# EasyEDA Pro project ProPrj_GoWinSDR_2025-10-27.epro, schematic Schematic1_1, sheets 5 to 8 of 8

## Sheets
5 Interface: Page Name: Interface; Update Date: 2025-09-11; Company: 嘉立创EDA
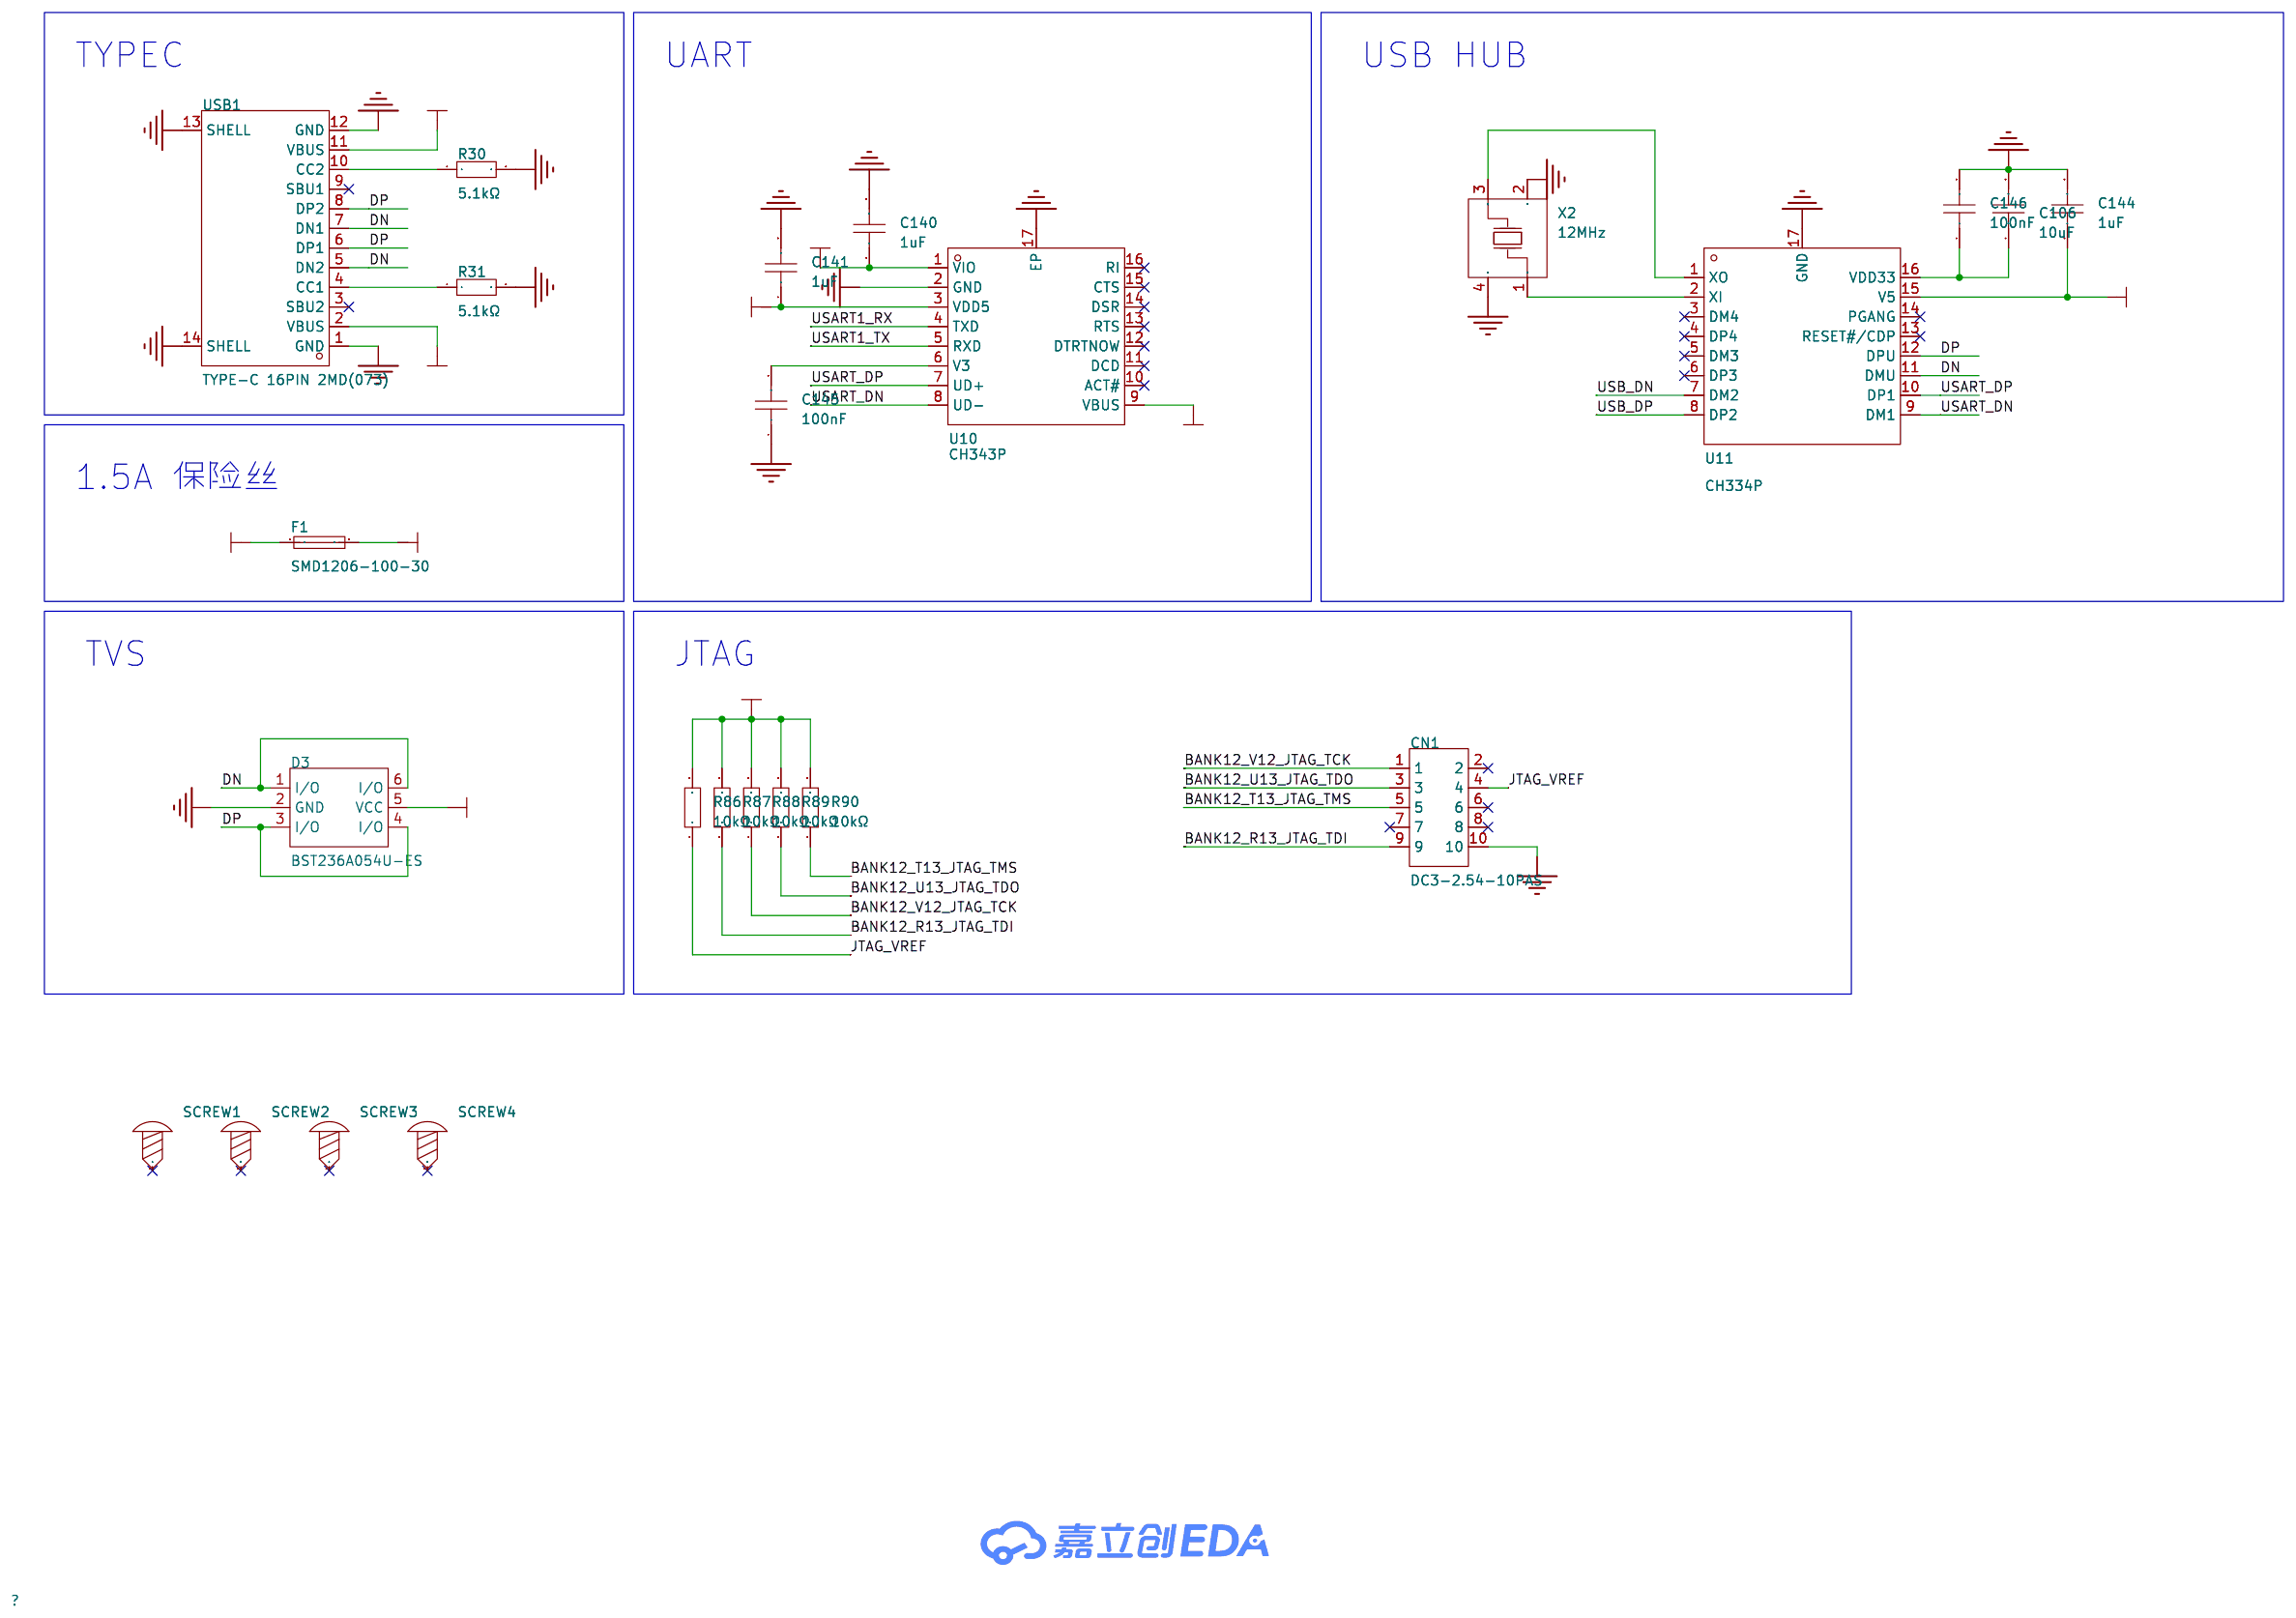
[diagram p4: Interface]
6 RF: Page Name: RF; Update Date: 2025-09-04; Company: 嘉立创EDA
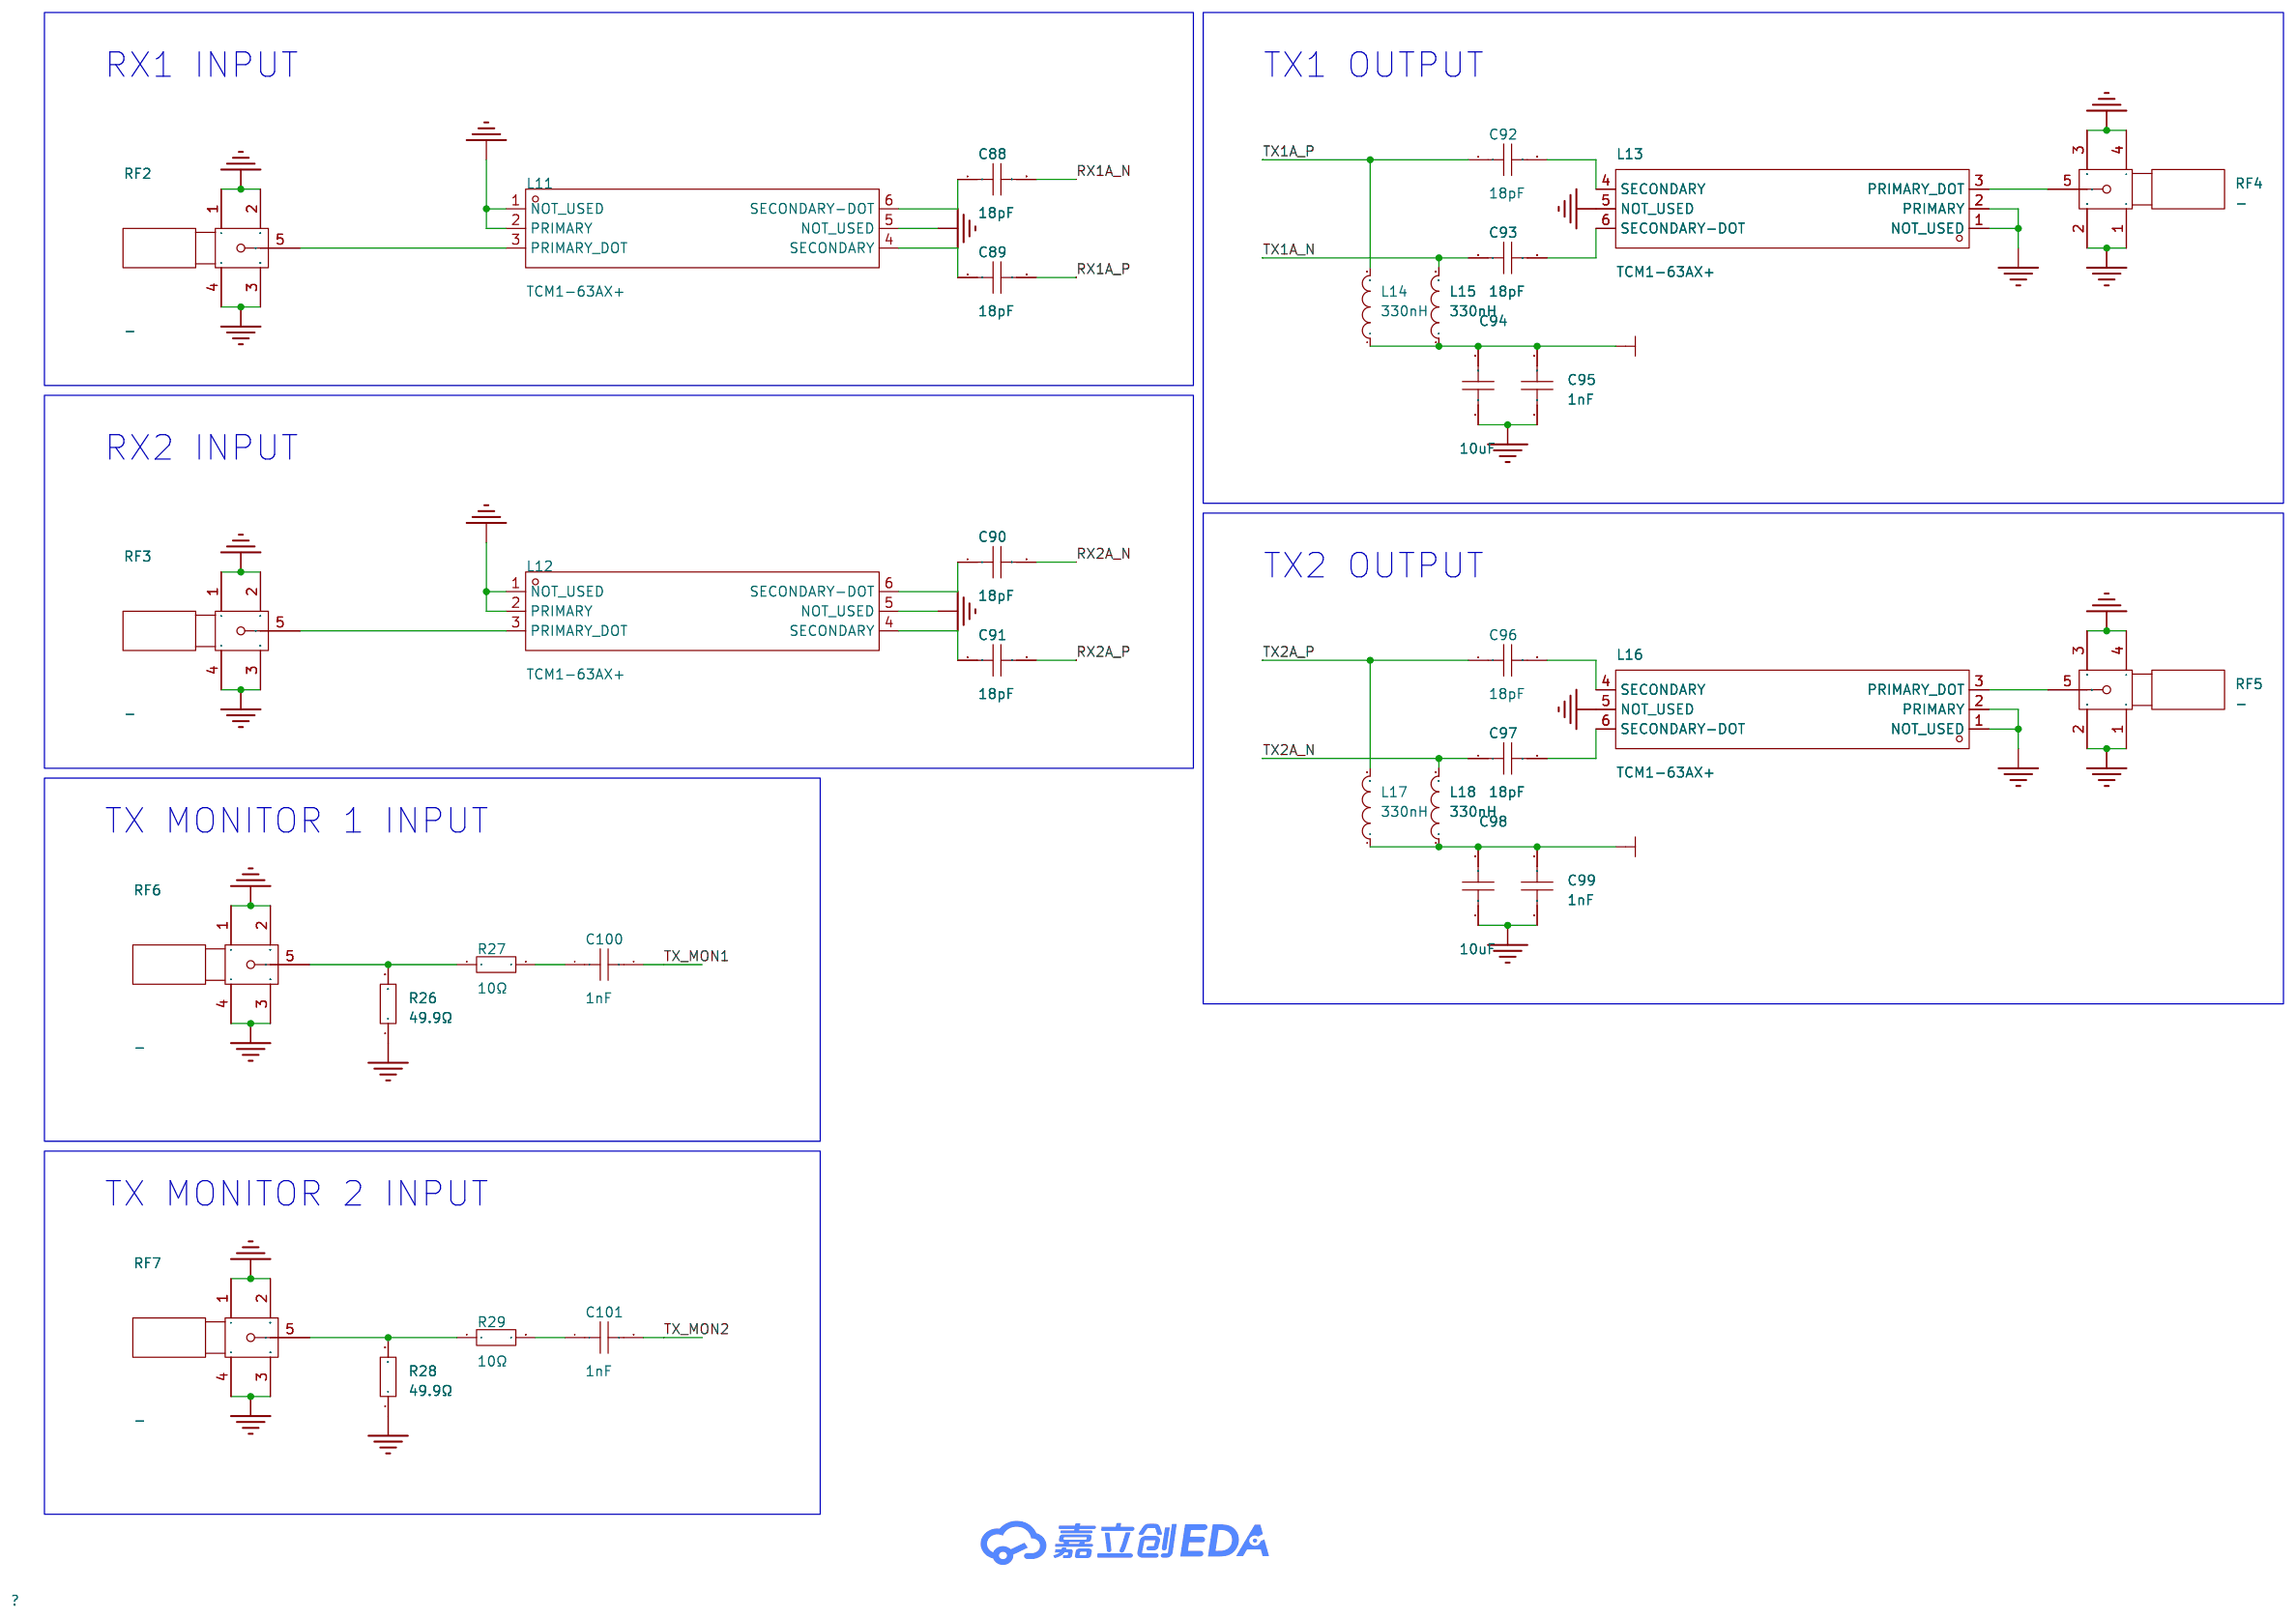
[diagram p5: RF]
7 ETHERNET: Board Name: Board1_1; Create Date: 2025-10-21; Page Name: ETHERNET; Schematic Name: Schematic1_1; Update Date: 2025-10-21; Company: 嘉立创EDA
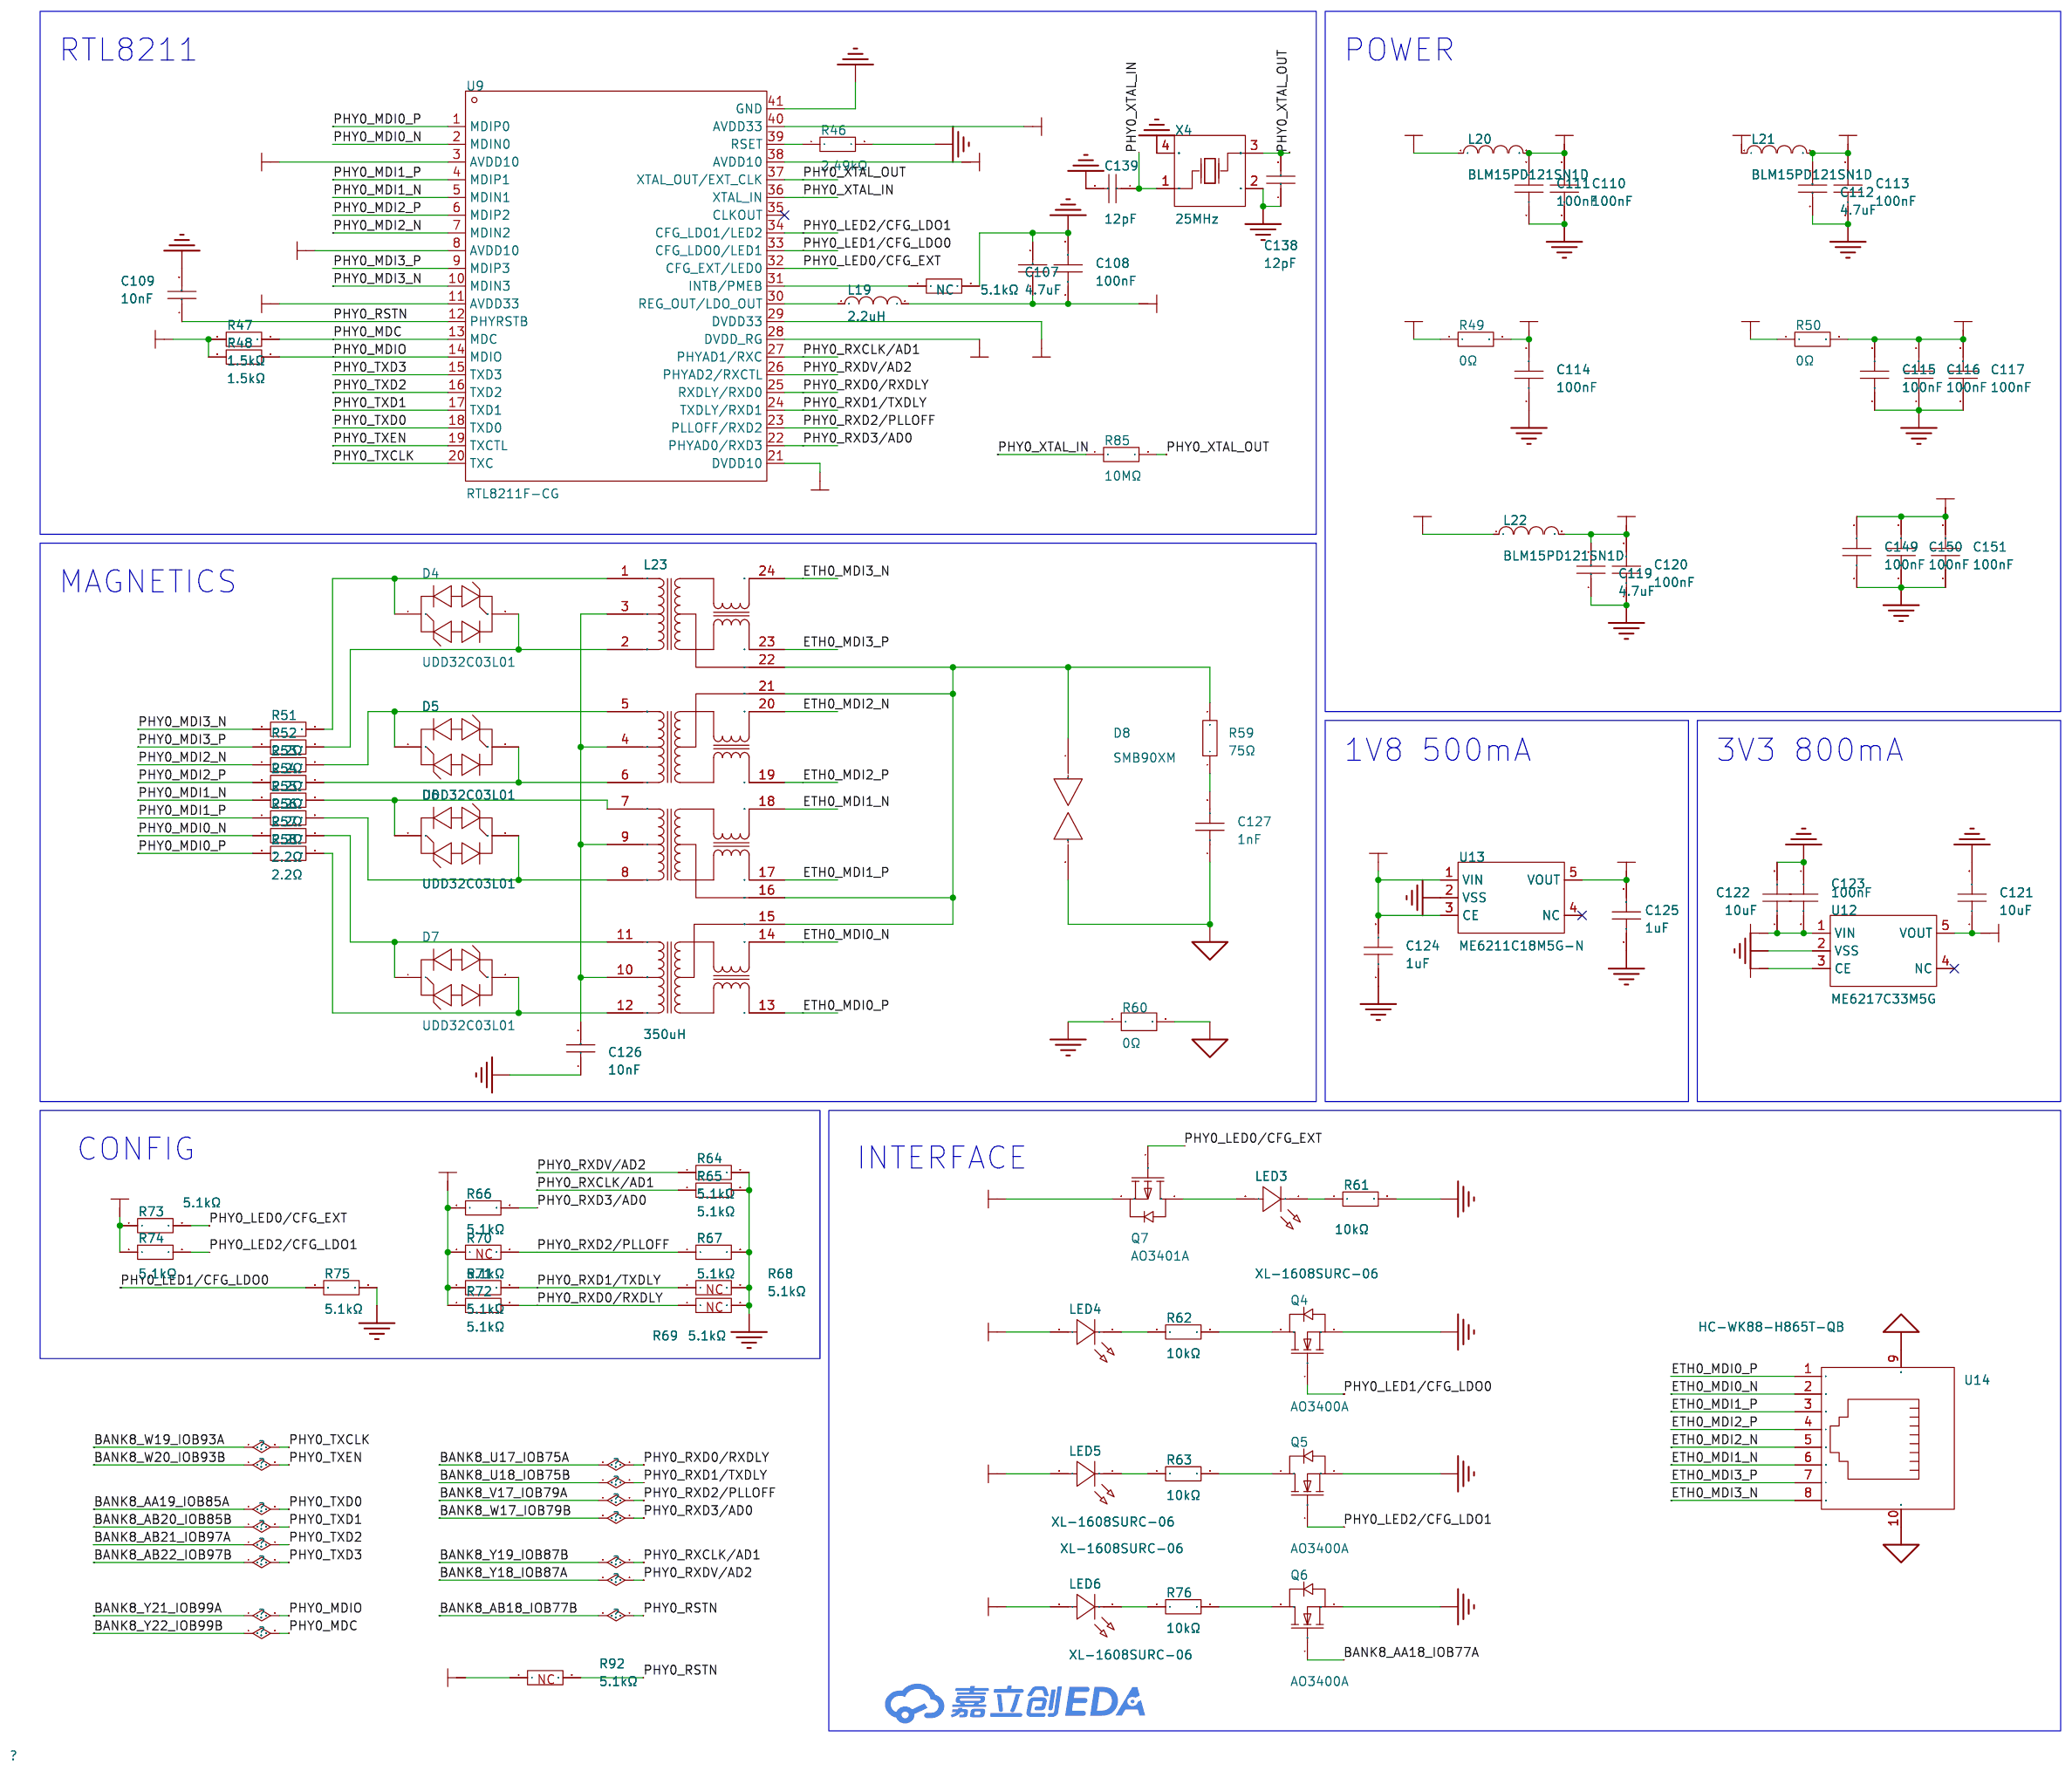
[diagram p6: ETHERNET]
8 USB: Create Date: 2025-09-07; Page Name: USB; Update Date: 2025-09-26; Company: 嘉立创EDA
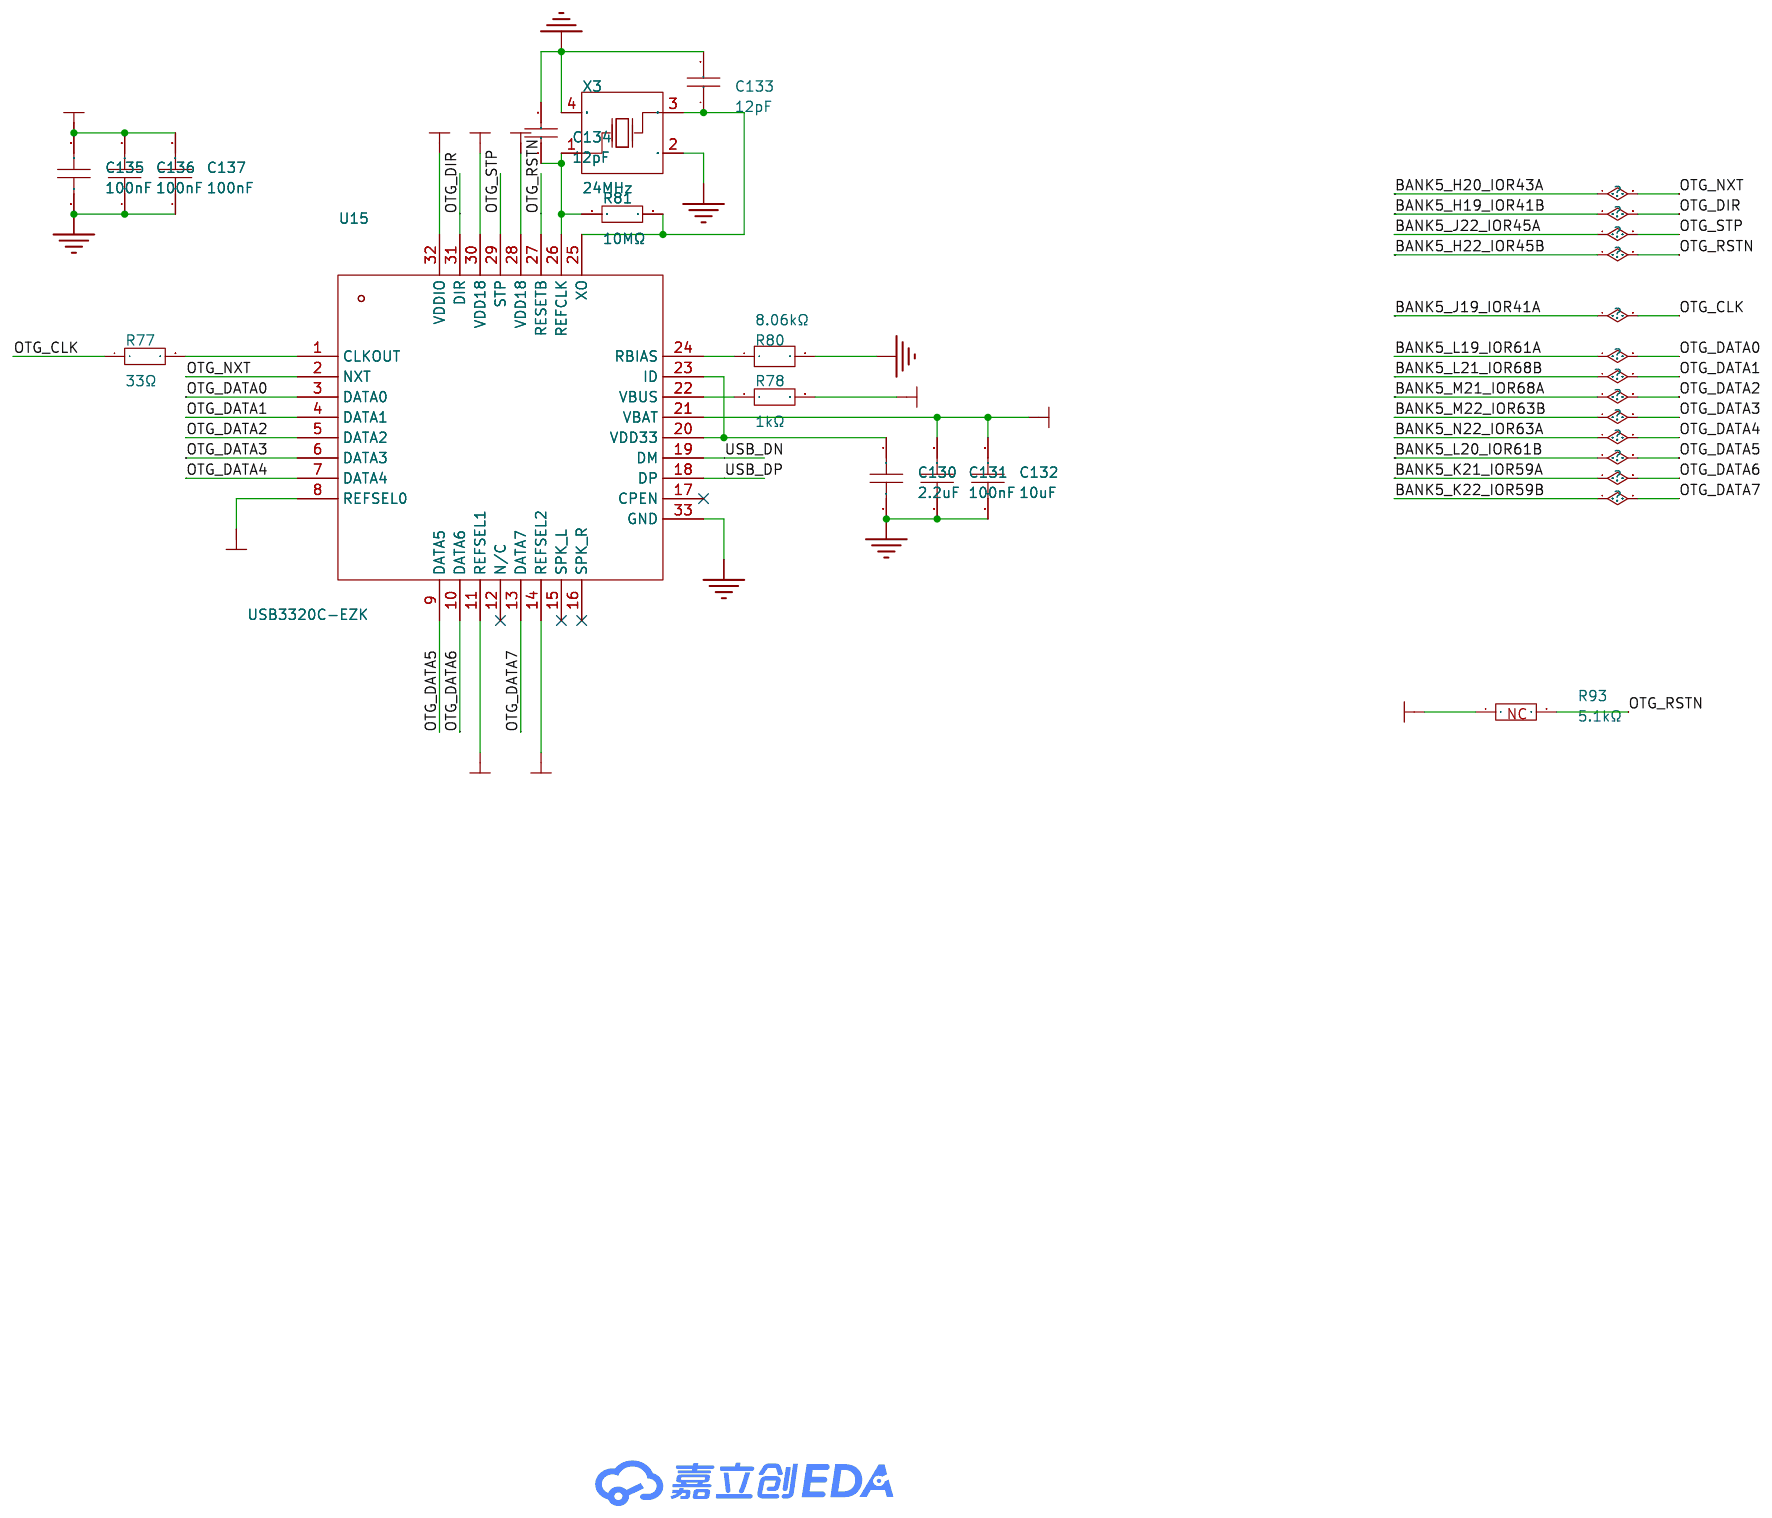
[diagram p7: USB]

## Parts
sheet ETHERNET
C107  4.7uF  [C0402]
C108  100nF  [C0402]
C109  10nF  [C0402]
C110  100nF  [C0402]
C111  100nF  [C0402]
C112  4.7uF  [C0402]
C113  100nF  [C0402]
C114  100nF  [C0402]
C115  100nF  [C0402]
C116  100nF  [C0402]
C117  100nF  [C0402]
C119  4.7uF  [C0402]
C120  100nF  [C0402]
C121  10uF  [C0603]
C122  10uF  [C0603]
C123  100nF  [C0603]
C124  1uF  [C0603]
C125  1uF  [C0603]
C126  10nF  [C0402]
C127  1nF  [C2220]
C138  12pF  [C0402]
C139  12pF  [C0402]
C149  100nF  [C0402]
C150  100nF  [C0402]
C151  100nF  [C0402]
D4  UDD32C03L01  [SOD-323_L1.7-W1.3-LS2.5-BI]
D5  UDD32C03L01  [SOD-323_L1.7-W1.3-LS2.5-BI]
D6  UDD32C03L01  [SOD-323_L1.7-W1.3-LS2.5-BI]
D7  UDD32C03L01  [SOD-323_L1.7-W1.3-LS2.5-BI]
D8  SMB90XM  [DIO-DT-SMD_L3.2-W1.6]
L19  2.2uH  [IND-SMD_L2.5-W2.0_MHCHL2520]
L20  BLM15PD121SN1D  [L0402]
L21  BLM15PD121SN1D  [L0402]
L22  BLM15PD121SN1D  [L0402]
L23  350uH  [XFMR-SMD_24P-L15.6-W8.5-P1.27-LS9.5-BL]
LED3  XL-1608SURC-06  [LED0603-RD_RED]
LED4  XL-1608SURC-06  [LED0603-RD_RED]
LED5  XL-1608SURC-06  [LED0603-RD_RED]
LED6  XL-1608SURC-06  [LED0603-RD_RED]
NC  5.1kΩ  [R0402]
Q4  AO3400A  [SOT-23-3_L2.9-W1.3-P1.90-LS2.4-BR]
Q5  AO3400A  [SOT-23-3_L2.9-W1.3-P1.90-LS2.4-BR]
Q6  AO3400A  [SOT-23-3_L2.9-W1.3-P1.90-LS2.4-BR]
Q7  AO3401A  [SOT-23_L2.9-W1.3-P1.90-LS2.4-BR]
R46  2.49kΩ  [R0402]
R47  1.5kΩ  [R0402]
R48  1.5kΩ  [R0402]
R49  0Ω  [R0402]
R50  0Ω  [R0402]
R51  2.2Ω  [R0402]
R52  2.2Ω  [R0402]
R53  2.2Ω  [R0402]
R54  2.2Ω  [R0402]
R55  2.2Ω  [R0402]
R56  2.2Ω  [R0402]
R57  2.2Ω  [R0402]
R58  2.2Ω  [R0402]
R59  75Ω  [R1206]
R60  0Ω  [R1206]
R61  10kΩ  [R0402]
R62  10kΩ  [R0402]
R63  10kΩ  [R0402]
R64  5.1kΩ  [R0402]
R65  5.1kΩ  [R0402]
R66  5.1kΩ  [R0402]
R67  5.1kΩ  [R0402]
R68  5.1kΩ  [R0402]
R69  5.1kΩ  [R0402]
R70  5.1kΩ  [R0402]
R71  5.1kΩ  [R0402]
R72  5.1kΩ  [R0402]
R73  5.1kΩ  [R0402]
R74  5.1kΩ  [R0402]
R75  5.1kΩ  [R0402]
R76  10kΩ  [R0402]
R85  10MΩ  [R0402]
R92  5.1kΩ  [R0402]
U9  RTL8211F-CG  [WQFN-40_L5.0-W5.0-P0.4-BL-EP]
U12  ME6217C33M5G  [SOT-23-5_L3.0-W1.7-P0.95-LS2.8-BR]
U13  ME6211C18M5G-N  [SOT-23-5_L3.0-W1.7-P0.95-LS2.8-BR]
U14  HC-WK88-H865T-QB  [RJ45-TH_HC-WK88-H865T-BB]
X4  25MHz  [CRYSTAL-SMD_4P-L3.2-W2.5-BL]
sheet Interface
C106  10uF  [C0603]
C140  1uF  [C0402]
C141  1uF  [C0402]
C144  1uF  [C0402]
C145  100nF  [C0402]
C146  100nF  [C0402]
CN1  DC3-2.54-10PAS  [CONN-TH_10P-P2.54_DC3-2.54-10PAS]
D3  BST236A054U-ES  [SOT-23-6_L2.9-W1.6-P0.95-LS2.8-TL]
F1  SMD1206-100-30  [F1206]
R30  5.1kΩ  [R0402]
R31  5.1kΩ  [R0402]
R86  10kΩ  [R0402]
R87  10kΩ  [R0402]
R88  10kΩ  [R0402]
R89  10kΩ  [R0402]
R90  10kΩ  [R0402]
SCREW1  -  [M3螺丝]
SCREW2  -  [M3螺丝]
SCREW3  -  [M3螺丝]
SCREW4  -  [M3螺丝]
U10  CH343P  [TQFN-16_L3.0-W3.0-P0.50-BL-EP1.7]
U11  CH334P  [QFN-16_L3.0-W3.0-P0.50-BL-EP1.7]
USB1  TYPE-C 16PIN 2MD(073)  [USB-C-SMD_TYPE-C-6PIN-2MD-073]
X2  12MHz  [CRYSTAL-SMD_4P-L3.2-W2.5-BL]
sheet RF
C88  18pF  [C0402]
C89  18pF  [C0402]
C90  18pF  [C0402]
C91  18pF  [C0402]
C92  18pF  [C0402]
C93  18pF  [C0402]
C94  10uF  [C0603]
C95  1nF  [C0402]
C96  18pF  [C0402]
C97  18pF  [C0402]
C98  10uF  [C0603]
C99  1nF  [C0402]
C100  1nF  [C0402]
C101  1nF  [C0402]
L11  TCM1-63AX+  [XFMR-SMD_TCM1-63AX]
L12  TCM1-63AX+  [XFMR-SMD_TCM1-63AX]
L13  TCM1-63AX+  [XFMR-SMD_TCM1-63AX]
L14  330nH  [IND-SMD_L1.0-W0.6]
L15  330nH  [IND-SMD_L1.0-W0.6]
L16  TCM1-63AX+  [XFMR-SMD_TCM1-63AX]
L17  330nH  [IND-SMD_L1.0-W0.6]
L18  330nH  [IND-SMD_L1.0-W0.6]
R26  49.9Ω  [R0402]
R27  10Ω  [R0402]
R28  49.9Ω  [R0402]
R29  10Ω  [R0402]
RF2  -  [SMA-SMD_BWSMA-KE-P001]
RF3  -  [SMA-SMD_BWSMA-KE-P001]
RF4  -  [SMA-SMD_BWSMA-KE-P001]
RF5  -  [SMA-SMD_BWSMA-KE-P001]
RF6  -  [SMA-SMD_BWSMA-KE-P001]
RF7  -  [SMA-SMD_BWSMA-KE-P001]
sheet USB
C130  2.2uF  [C0402]
C131  100nF  [C0402]
C132  10uF  [C0603]
C133  12pF  [C0402]
C134  12pF  [C0402]
C135  100nF  [C0402]
C136  100nF  [C0402]
C137  100nF  [C0402]
R77  33Ω  [R0402]
R78  1kΩ  [R0402]
R80  8.06kΩ  [R0402]
R81  10MΩ  [R0402]
R93  5.1kΩ  [R0402]
U15  USB3320C-EZK  [QFN-32_L5.0-W5.0-P0.50-BL-EP3.4]
X3  24MHz  [CRYSTAL-SMD_4P-L3.2-W2.5-BL]

## Library data of the parts
C107 C112 C119 = CL05A475MP5NRNC: 容值:4.7uF;精度:±20%;额定电压:10V;温度系数:X5R;; LCSC Part Name: 4.7uF ±20% 10V; Supplier Part: C23733; Manufacturer: SAMSUNG(三星); Supplier Footprint: 0402; JLCPCB Part Class: 基础库; Datasheet: https://item.szlcsc.com/datasheet/CL05A475MP5NRNC/24469.html; Supplier: LCSC; Tolerance: ±20%; Voltage Rating: 10V; Temperature Coefficient: X5R
C108 C113 C120 = GRM155R71H104KE14D: 容值:100nF;精度:±10%;额定电压:50V;材质(温度系数):X7R;; LCSC Part Name: 100nF ±10% 50V; Supplier Part: C77020; Manufacturer: muRata(村田); Supplier Footprint: 0402; JLCPCB Part Class: 扩展库; Datasheet: https://atta.szlcsc.com/upload/public/pdf/source/20180326/C77020_39BD49C951FF1AF0DB1F1FAC5AC1E401.pdf; Supplier: LCSC; Tolerance: ±10%; Voltage Rated: 50V; Temperature Coefficient: X7R
C109 C126 = CL05B103KB5NNNC: 容值:10nF;精度:±10%;额定电压:50V;温度系数:X7R;; LCSC Part Name: 10nF ±10% 50V; Supplier Part: C15195; Manufacturer: SAMSUNG(三星); Supplier Footprint: 0402; JLCPCB Part Class: 基础库; Datasheet: https://item.szlcsc.com/datasheet/CL05B103KB5NNNC/15869.html; Supplier: LCSC; Tolerance: ±10%; Voltage Rating: 50V; Temperature Coefficient: X7R
C110 C111 C114-C117 C131 C135-C137 C145 C146 C149-C151 = CL05B104KB54PNC: 容值:100nF;精度:±10%;额定电压:50V;温度系数:X7R;; LCSC Part Name: 100nF ±10% 50V; Supplier Part: C307331; Manufacturer: SAMSUNG(三星); Supplier Footprint: 0402; JLCPCB Part Class: 基础库; Datasheet: https://item.szlcsc.com/datasheet/CL05B104KB54PNC/291005.html; Supplier: LCSC; Tolerance: ±10%; Voltage Rating: 50V; Temperature Coefficient: X7R
C94 C98 C106 C121 C122 C132 = CGA0603X5R106K100JT: 容值:10uF;精度:±10%;额定电压:10V;温度系数:X5R;; LCSC Part Name: 10uF ±10% 10V; Supplier Part: C6119842; Manufacturer: HRE(芯声); Supplier Footprint: 0603; JLCPCB Part Class: 扩展库; Supplier: LCSC; Tolerance: ±10%; Voltage Rating: 10V; Temperature Coefficient: X5R
C123 = CGA0603X7R104K500JT: 容值:100nF;精度:±10%;额定电压:50V;温度系数:X7R;; LCSC Part Name: 100nF ±10% 50V; Supplier Part: C6119867; Manufacturer: HRE(芯声); Supplier Footprint: 0603; JLCPCB Part Class: 扩展库; Datasheet: https://atta.szlcsc.com/upload/public/pdf/source/20250103/C44077DA9E7B3EFAE02F22B6D3D1CBC9.pdf; Supplier: LCSC; Tolerance: ±10%; Voltage Rating: 50V; Temperature Coefficient: X7R
C124 C125 = CGA0603X5R105K500JT: 容值:1uF;精度:±10%;额定电压:50V;温度系数:X5R;; LCSC Part Name: 1uF ±10% 50V; Supplier Part: C6119852; Manufacturer: HRE(芯声); Supplier Footprint: 0603; JLCPCB Part Class: 扩展库; Supplier: LCSC; Tolerance: ±10%; Voltage Rating: 50V; Temperature Coefficient: X5R
C127 = C2220X102K202T: 容值:1nF;精度:±10%;额定电压:2kV;温度系数:X7R;; LCSC Part Name: 1nF ±10% 2kV; Supplier Part: C2940745; Manufacturer: IHHEC(禾伸堂); Supplier Footprint: 2220; JLCPCB Part Class: 扩展库; Datasheet: https://item.szlcsc.com/datasheet/C2220X102K202T/3306377.html; Supplier: LCSC; Tolerance: ±10%; Voltage Rating: 2kV; Temperature Coefficient: X7R
C133 C134 C138 C139 = GRM1555C1H120JA01D: 容值:12pF;精度:±5%;额定电压:50V;温度系数:C0G;; LCSC Part Name: 12pF ±5% 50V; Supplier Part: C76948; Manufacturer: muRata(村田); Supplier Footprint: 0402; JLCPCB Part Class: 扩展库; Datasheet: https://item.szlcsc.com/datasheet/GRM1555C1H120JA01D/78075.html; Supplier: LCSC; Tolerance: ±5%; Voltage Rating: 50V; Temperature Coefficient: C0G
D4-D7 = UDD32C03L01_C42165090: 反向截止电压(Vrwm):3.3V;钳位电压:7V;峰值脉冲电流(Ipp):19A;峰值脉冲功率(Ppp):350W;击穿电压:4V;; Supplier Part: C42165090; Manufacturer: UMW(友台半导体); Supplier Footprint: SOD-323; Datasheet: https://item.szlcsc.com/datasheet/UDD32C03L01/44034558.html; Supplier: LCSC; Reverse Stand-Off Voltage (Vrwm): 3.3V; Clamping Voltage: 7V; Peak Pulse Current (Ipp): 19A; Peak Pulse Power Dissipation (Ppp): 350W; Voltage - Breakdown: 4V; Reverse Leakage Current (Ir): 5uA; Number of Channels: 单路; Operating Temperature: -55℃~+150℃; level of protection: IEC 61000-4-2; Type: TVS; Junction Capacitance: 0.8pF
D8 = SMB90XM: 极数:2;击穿电压:90V;精度:±30%;脉冲放电电流:500A;; LCSC Part Name: 90V 500A 2端 1206GDT; Supplier Part: C527147; Manufacturer: SURGING(绍鑫); Supplier Footprint: 1206; JLCPCB Part Class: 扩展库; Datasheet: https://atta.szlcsc.com/upload/public/pdf/source/20200508/C527150_F0D53D7FAFC2AA44B5719B72ADFAED31.pdf; Supplier: LCSC; Number of Poles: 2; Voltage - DC Spark Over (Nom): 90V; Tolerance: ±30%; Impulse Discharge Current: 500A; inter-electrode capacitance: 0.5pF
L19 = FTC252012S2R2MBCA: 电感值:2.2uH;精度:±20%;额定电流:3A;饱和电流(Isat):3.8A;类型:一体成型电感;; LCSC Part Name: 2.2uH ±20% 3.8A; Supplier Part: C5832372; Manufacturer: cjiang(长江微电); Supplier Footprint: 1008; JLCPCB Part Class: 扩展库; Datasheet: https://atta.szlcsc.com/upload/public/pdf/source/20230602/8FFEDA9C0247A92A0D4B67554BFE4091.pdf; Supplier: LCSC; Tolerance: ±20%; Rated Current: 3A; Saturation Current (Isat): 3.8A; DC Resistance (DCR): 55mΩ; Type: 一体成型电感
L20-L22 = BLM15PD121SN1D: 阻抗@频率:120Ω@100MHz;误差:±25%;直流电阻(DCR):90mΩ;; LCSC Part Name: 单路 0402磁珠 阻抗120Ω@100MHz; Supplier Part: C76891; Manufacturer: muRata(村田); Supplier Footprint: 0402; JLCPCB Part Class: 扩展库; Datasheet: https://item.szlcsc.com/datasheet/BLM15PD121SN1D/78018.html; Supplier: LCSC; Impedance @ Frequency: 120Ω@100MHz; Tolerance: ±25%; DC Resistance(DCR): 90mΩ; Current Rating: 1.3A; Number of Circuits: 1; Operating Temperature: -55℃~+125℃
L23 = HM82409S: 匝数比:1:1;端口数量:单口;速率:1000M;; Supplier Part: C48392699; Manufacturer: CND-tek(磁联达); Supplier Footprint: SMD-24P,15.6x8.5mm; JLCPCB Part Class: 扩展库; Datasheet: https://atta.szlcsc.com/upload/public/pdf/source/20250418/F0A2D7AC90CE8B5B5C678EEBBDC00628.pdf; Supplier: LCSC; Turns Ratio: 1:1; Number of Channels: 单口; rate: 1000M; Isolation Voltage(Vrms): 1.5kV; operating temperature: 0℃~+70℃
LED3-LED6 = XL-1608SURC-06: 灯头类型:-;发光颜色:红色;正向压降(Vf):2.3V;功率:50mW;正向电流:20mA;波长:620nm~630nm;二极管配置:-;透镜颜色:无色透明透镜;色温:-;发光强度:225mcd;发光角度:120°;载带方式:正贴;工作温度:-20℃~+85℃;; Supplier Part: C965799; Manufacturer: XINGLIGHT(成兴光); Supplier Footprint: 0603; JLCPCB Part Class: 扩展库; Datasheet: https://atta.szlcsc.com/upload/public/pdf/source/20250213/F9766CE804AF391355DCDD48DB3E0DAB.pdf; Supplier: LCSC; Illumination Color: 红色; Voltage - Forward(Vf): 2.3V; Power(Watts): 50mW; Forward Current: 20mA; Wavelength - Dominant: 620nm~630nm; Peak Wavelength: 625nm; Lens Color: 无色透明透镜; Luminous Intensity: 225mcd; Viewing Angle: 120°; Mounting Sytle: 正贴; Operating Temperature: -20℃~+85℃
NC R30 R31 R64-R75 R92 R93 = 0402WGF5101TCE: 电阻类型:厚膜电阻;阻值:5.1kΩ;精度:±1%;功率:62.5mW;工作电压:50V;温度系数:±100ppm/℃;; LCSC Part Name: 5.1kΩ ±1% 62.5mW 厚膜电阻; Supplier Part: C25905; Manufacturer: UNI-ROYAL(厚声); Supplier Footprint: 0402; JLCPCB Part Class: 基础库; Datasheet: https://item.szlcsc.com/datasheet/0402WGF5101TCE/26648.html; Supplier: LCSC; Type: 厚膜电阻; Tolerance: ±1%; Power(Watts): 62.5mW; Voltage-Supply(Max): 50V; Temperature Coefficient: ±100ppm/℃; Operating Temperature: -55℃~+155℃
Q4-Q6 = AO3400A_C20917: 数量:-;漏源电压(Vdss):30V;连续漏极电流(Id):-;导通电阻(RDS(on)):48mΩ@2.5V;耗散功率(Pd):-;阈值电压(Vgs(th)):1.45V@250uA;; LCSC Part Name: 1个N沟道 耐压:30V 电流:5.7A; Supplier Part: C20917; Manufacturer: AOS; Supplier Footprint: SOT-23-3L; JLCPCB Part Class: 基础库; Datasheet: https://item.szlcsc.com/datasheet/AO3400A/21629.html; Supplier: LCSC; Drain to Source Voltage: 30V; RDS(on): 48mΩ@2.5V; Gate Threshold Voltage (Vgs(th)): 1.45V@250uA; Gate Charge(Qg): 7nC@10V; Input Capacitance(Ciss): 630pF@15V; Operating Temperature: -55℃~+150℃@(Tj); Type: N沟道
Q7 = AO3401A_C15127: 数量:1个P沟道;漏源电压(Vdss):30V;连续漏极电流(Id):4A;导通电阻(RDS(on)):47mΩ@10V；85mΩ@2.5V；60mΩ@4.5V;耗散功率(Pd):-;阈值电压(Vgs(th)):900mV@250uA;; LCSC Part Name: 1个P沟道 耐压:30V 电流:4A; Supplier Part: C15127; Manufacturer: AOS; Supplier Footprint: SOT-23; JLCPCB Part Class: 基础库; Datasheet: https://item.szlcsc.com/datasheet/AO3401A/15801.html; Supplier: LCSC; Number: 1个P沟道; Drain to Source Voltage: 30V; Current - Continuous Drain(Id): 4A; RDS(on): 47mΩ@10V；85mΩ@2.5V；60mΩ@4.5V; Gate Threshold Voltage (Vgs(th)): 900mV@250uA; Gate Charge(Qg): 14nC@10V; Input Capacitance(Ciss): 645pF; Reverse Transfer Capacitance (Crss@Vds): 55pF; Output Capacitance(Coss): 80pF
R46 = 0402WGF2491TCE: 电阻类型:厚膜电阻;阻值:2.49kΩ;精度:±1%;功率:62.5mW;工作电压:50V;温度系数:±100ppm/℃;; LCSC Part Name: 2.49kΩ ±1% 62.5mW 厚膜电阻; Supplier Part: C25884; Manufacturer: UNI-ROYAL(厚声); Supplier Footprint: 0402; JLCPCB Part Class: Extended Part; Datasheet: https://item.szlcsc.com/datasheet/0402WGF2491TCE/26627.html; Supplier: LCSC; Type: 厚膜电阻; Tolerance: ±1%; Power(Watts): 62.5mW; Voltage-Supply(Max): 50V; Temperature Coefficient: ±100ppm/℃; Operating Temperature: -55℃~+155℃
R47 R48 = 0402WGF1501TCE: 电阻类型:厚膜电阻;阻值:1.5kΩ;精度:±1%;功率:62.5mW;最大工作电压:50V;温度系数:±100ppm/℃;; LCSC Part Name: 1.5kΩ ±1% 62.5mW 厚膜电阻; Supplier Part: C25867; Manufacturer: UNI-ROYAL(厚声); Supplier Footprint: 0402; JLCPCB Part Class: 基础库; Datasheet: https://atta.szlcsc.com/upload/public/pdf/source/20200306/C422600_1E6D84923E4A46A82E41ADD87F860B5C.pdf; Supplier: LCSC; Type: 厚膜电阻; Tolerance: ±1%; Power(Watts): 62.5mW; Overload Voltage (Max): 50V; Temperature Coefficient: ±100ppm/℃; Operating Temperature Range: -55℃~+155℃
R49 R50 = 0402WGF0000TCE: 电阻类型:厚膜电阻;阻值:0Ω;精度:±1%;功率:62.5mW;工作电压:50V;温度系数:±800ppm/℃;; LCSC Part Name: 0Ω ±1% 62.5mW 厚膜电阻; Supplier Part: C17168; Manufacturer: UNI-ROYAL(厚声); Supplier Footprint: 0402; JLCPCB Part Class: 基础库; Datasheet: https://item.szlcsc.com/datasheet/0402WGF0000TCE/17853.html; Supplier: LCSC; Type: 厚膜电阻; Tolerance: ±1%; Power(Watts): 62.5mW; Voltage-Supply(Max): 50V; Temperature Coefficient: ±800ppm/℃; Operating Temperature: -55℃~+155℃
R51-R58 = 0402WGF220KTCE: 电阻类型:厚膜电阻;阻值:2.2Ω;精度:±1%;功率:62.5mW;最大工作电压:50V;温度系数:±200ppm/℃;; LCSC Part Name: 2.2Ω ±1% 62.5mW 厚膜电阻; Supplier Part: C25101; Manufacturer: UNI-ROYAL(厚声); Supplier Footprint: 0402; JLCPCB Part Class: 扩展库; Datasheet: https://atta.szlcsc.com/upload/public/pdf/source/20200306/C422600_1E6D84923E4A46A82E41ADD87F860B5C.pdf; Supplier: LCSC; Type: 厚膜电阻; Tolerance: ±1%; Power(Watts): 62.5mW; Overload Voltage (Max): 50V; Temperature Coefficient: ±200ppm/℃; Operating Temperature Range: -55℃~+155℃
R59 = 1206W4F750JT5E: 电阻类型:厚膜电阻;阻值:75Ω;精度:±1%;功率:250mW;最大工作电压:200V;温度系数:±100ppm/℃;; LCSC Part Name: 75Ω ±1% 250mW 厚膜电阻; Supplier Part: C17987; Manufacturer: UNI-ROYAL(厚声); Supplier Footprint: 1206; JLCPCB Part Class: 扩展库; Datasheet: https://atta.szlcsc.com/upload/public/pdf/source/20200306/C422600_1E6D84923E4A46A82E41ADD87F860B5C.pdf; Supplier: LCSC; Type: 厚膜电阻; Tolerance: ±1%; Power(Watts): 250mW; Overload Voltage (Max): 200V; Temperature Coefficient: ±100ppm/℃; Operating Temperature Range: -55℃~+155℃
R60 = RE1206F1R000: 电阻类型:采样电阻；合金电阻;阻值:0Ω;精度:±1%;功率:1W;; LCSC Part Name: 0mΩ 1W 1206 ±1%; Supplier Part: C46961765; Manufacturer: JIERR(捷而瑞); Supplier Footprint: 1206; JLCPCB Part Class: 扩展库; Datasheet: https://item.szlcsc.com/datasheet/RE1206F1R000/49133304.html; Supplier: LCSC; Type: 采样电阻；合金电阻; Tolerance: ±1%; Power(Watts): 1W
R61-R63 R76 = 0402WGF3301TCE: 电阻类型:厚膜电阻;阻值:3.3kΩ;精度:±1%;功率:62.5mW;工作电压:50V;温度系数:±100ppm/℃;; LCSC Part Name: 3.3kΩ ±1% 62.5mW 厚膜电阻; Supplier Part: C25890; Manufacturer: UNI-ROYAL(厚声); Supplier Footprint: 0402; JLCPCB Part Class: 基础库; Datasheet: https://item.szlcsc.com/datasheet/0402WGF3301TCE/26633.html; Supplier: LCSC; Type: 厚膜电阻; Tolerance: ±1%; Power(Watts): 62.5mW; Voltage-Supply(Max): 50V; Temperature Coefficient: ±100ppm/℃; Operating Temperature: -55℃~+155℃
R81 R85 = RC0402FR-0710ML: 电阻类型:厚膜电阻;阻值:10MΩ;精度:±1%;功率:62.5mW;工作电压:50V;温度系数:±100ppm/℃;; LCSC Part Name: 厚膜电阻 10MΩ ±1% 62.5mW; Supplier Part: C138067; Manufacturer: YAGEO(国巨); Supplier Footprint: 0402; JLCPCB Part Class: 扩展库; Datasheet: https://item.szlcsc.com/datasheet/RC0402FR-0710ML/149383.html; Supplier: LCSC; Type: 厚膜电阻; Tolerance: ±1%; Power(Watts): 62.5mW; Voltage-Supply(Max): 50V; Temperature Coefficient: ±100ppm/℃; Operating Temperature: -55℃~+155℃
U9 = RTL8211F-CG: 应用功能:-;通道数:-;MAC接口:RGMII;; LCSC Part Name: 集成10/100/1000M以太网精密收发器; Supplier Part: C187932; Manufacturer: REALTEK(瑞昱); Supplier Footprint: WQFN-40-EP(5x5); JLCPCB Part Class: 扩展库; Datasheet: https://item.szlcsc.com/datasheet/RTL8211F-CG/199338.html; Supplier: LCSC; MAC Interface: RGMII; Voltage - Supply: 1.8V；2.5V；3.3V；1.5V
U12 = ME6217C33M5G: 输出类型:固定;工作电压:6.5V;输出电压:3.3V;输出电流:800mA;电源纹波抑制比(PSRR):65dB@(1kHz);输出极性:正极;; LCSC Part Name: 输入7V 输出3.3V 800mA; Supplier Part: C427602; Manufacturer: MICRONE(南京微盟); Supplier Footprint: SOT-23-5; JLCPCB Part Class: 扩展库; Datasheet: https://item.szlcsc.com/datasheet/ME6217C33M5G/421842.html; Supplier: LCSC; Output Type: 固定; Voltage - Supply: 6.5V; Output Voltage: 3.3V; Output Current: 800mA; Power Supply Rejection Ratio (PSRR): 65dB@(1kHz); Voltage Dropout: 180mV@(300mA); standby current: 100uA; Features: 过热保护；带使能; Operating Temperature: -40℃~+85℃; Output Configuration: 正极; Number of Outputs: 1
U13 = ME6211C18M5G-N: 输出类型:固定;工作电压:6.5V;输出电压:1.8V;输出电流:300mA;电源纹波抑制比(PSRR):70dB@(1kHz);输出极性:正极;; LCSC Part Name: 输入6.5V 输出1.8V 300mA; Supplier Part: C236671; Manufacturer: MICRONE(南京微盟); Supplier Footprint: SOT-23-5; JLCPCB Part Class: 扩展库; Datasheet: https://atta.szlcsc.com/upload/public/pdf/source/20180801/C94042_8FDAFF138ADDED65E3D077205E9A8C17.pdf; Supplier: LCSC; Output Type: 固定; Voltage - Supply: 6.5V; Output Voltage: 1.8V; Output Current: 300mA; Power Supply Rejection Ratio (PSRR): 70dB@(1kHz); Voltage Dropout: 400mV@(200mA); Features: 过流保护(OCP); Output Configuration: 正极; Number of Outputs: 1
U14 = HC-WK88-H865T-QB: 连接器类型:RJ45插座;安装方式:沉板;端口数量:1;LED:不带LED;屏蔽:有屏蔽;等级:-;触头材质:铜;触头镀层:金;工作温度:-25℃~+70℃;; LCSC Part Name: 沉板 不带LED 网口 RJ45沉板不带LED 带壳全包H=8.65 编带 铜壳; Supplier Part: C7501812; Manufacturer: HC(虹成电子); Supplier Footprint: SMD; JLCPCB Part Class: 扩展库; Datasheet: https://item.szlcsc.com/datasheet/HC-WK88-H865T-QB/8585353.html; Supplier: LCSC; Connector Type: RJ45插座; Mounting Type: 沉板; Number of Ports: 1; LED: 不带LED; Shielding: 有屏蔽; Contact Material: 铜; Contact Plating: 金; Operating Temperature: -25℃~+70℃
X4 = X322525MOB4SI: 晶振类型:贴片晶振;频率:25MHz;常温频差:±10ppm;负载电容:12pF;频率稳定度:±20ppm;; LCSC Part Name: YSX321SL 25MHZ 4P 3225 12PF ±10PPM -40~85℃ (±20PPM); Supplier Part: C9006; Manufacturer: YXC(扬兴晶振); Supplier Footprint: SMD3225-4P; JLCPCB Part Class: 基础库; Datasheet: https://item.szlcsc.com/datasheet/X322525MOB4SI/9526.html; Supplier: LCSC; Type: 贴片晶振; Normal temperature Frequency Tolerance: ±10ppm; Load Capacitance: 12pF; Frequency Stability: ±20ppm; Operating Temperature: -40℃~+85℃
C140 C141 C144 = CL05A105KA5NQNC: 容值:1uF;精度:±10%;额定电压:25V;温度系数:X5R;; LCSC Part Name: 1uF ±10% 25V; Supplier Part: C52923; Manufacturer: SAMSUNG(三星); Supplier Footprint: 0402; JLCPCB Part Class: 基础库; Datasheet: https://item.szlcsc.com/datasheet/CL05A105KA5NQNC/53938.html; Supplier: LCSC; Tolerance: ±10%; Voltage Rating: 25V; Temperature Coefficient: X5R
CN1 = DC3-2.54-10PAS: 连接器类型:简牛座;间距:2.54mm;结构:2x5P;额定电流:1.5A;额定电压:-;安装方式:直插;行距:2.54mm;排数:2;每排PIN数:5;工作温度:-40℃~+105℃;; LCSC Part Name: 2.54mm 2x5P 排数:2 每排P数:5; Supplier Part: C2977596; Manufacturer: ZHOURI(洲日); Supplier Footprint: 插件,P=2.54mm; JLCPCB Part Class: 扩展库; Datasheet: https://item.szlcsc.com/datasheet/DC3-2.54-10PAS/3388948.html; Supplier: LCSC; Connector Type: 简牛座; Pitch: 2.54mm; Number of Positions or Pins: 2x5P; Current Rating: 1.5A; Holder Type: 直插; Row Spacing: 2.54mm; Number of Rows: 2; Number of PINs Per Row: 5; Operating Temperature: -40℃~+105℃
D3 = BST236A054U-ES: 极性:单向;反向截止电压(Vrwm):5V;钳位电压:12V;峰值脉冲电流(Ipp):4.5A;峰值脉冲功率(Ppp):60W;击穿电压:6V;; LCSC Part Name: V05，4路单向+带VBUS防护ESD静电防护器件，20kV，CJ：0.6pF；HDMI/USB/RJ45高速接口通讯防护; Supplier Part: C5199218; Manufacturer: ElecSuper(静芯微); Supplier Footprint: SOT23-6L; JLCPCB Part Class: 扩展库; Datasheet: https://atta.szlcsc.com/upload/public/pdf/source/20240905/4F7B9CA972E11A794CCFD621318AA126.pdf; Supplier: LCSC; Polarity: 单向; Reverse Stand-Off Voltage (Vrwm): 5V; Clamping Voltage: 12V; Peak Pulse Current (Ipp): 4.5A; Peak Pulse Power Dissipation (Ppp): 60W; Voltage - Breakdown: 6V; Reverse Leakage Current (Ir): 1uA; Number of Channels: 四路; Type: ESD
F1 = SMD1206-100-30: 耐压(Vmax):30V;最大电流(Imax):40A;保持电流(Ihold):1A;跳闸电流(Itrip):1.8A;; Supplier Part: C46641026; Manufacturer: 宏嘉诚; Supplier Footprint: 1206; JLCPCB Part Class: 扩展库; Datasheet: https://item.szlcsc.com/datasheet/SMD1206-100-30/48798732.html; Supplier: LCSC; Voltage - Max: 30V; Current - Max: 40A; Hold Current: 1A; Trip Current: 1.8A; Power Dissipation: 1W; Resistance - Initial (Ri) (Min): 50mΩ; Resistance - Post Trip (R1) (Max): 300mΩ; Time to Trip(Max): 300ms
R86-R90 = 0402WGF1002TCE: 电阻类型:厚膜电阻;阻值:10kΩ;精度:±1%;功率:62.5mW;工作电压:50V;温度系数:±100ppm/℃;; LCSC Part Name: 10kΩ ±1% 62.5mW 厚膜电阻; Supplier Part: C25744; Manufacturer: UNI-ROYAL(厚声); Supplier Footprint: 0402; JLCPCB Part Class: Basic Part; Datasheet: https://item.szlcsc.com/datasheet/0402WGF1002TCE/26487.html; Supplier: LCSC; Type: 厚膜电阻; Tolerance: ±1%; Power(Watts): 62.5mW; Voltage-Supply(Max): 50V; Temperature Coefficient: ±100ppm/℃; Operating Temperature: -55℃~+155℃
SCREW1-SCREW4 = M3螺丝: Supplier Footprint: 插件
U10 = CH343P: 应用功能:-;接口协议:-;; Supplier Part: C2846043; Manufacturer: WCH(南京沁恒); Supplier Footprint: TQFN-16-EP(3x3); JLCPCB Part Class: 扩展库; Datasheet: https://atta.szlcsc.com/upload/public/pdf/source/20211010/C2846043_7FA705E1F14A2906F6A2AFA45FA28209.pdf; Supplier: LCSC
U11 = CH334P: CH334和CH335是符合USB2.0协议规范的4端口USBHUB控制器芯片，上行端口支持USB2.0高速和全速，下行端口支持USB2.0高速480Mbps、全速12Mbps和低速1.5Mbps。; Supplier Part: C5373042; Manufacturer: WCH(南京沁恒); Supplier Footprint: QFN-16(3x3); JLCPCB Part Class: 扩展库; Datasheet: https://item.szlcsc.com/datasheet/CH334P/6226077.html; Supplier: LCSC; type: 集线器; Protocol: USB 2.0; Data Rate: 480Mbps; Voltage - Supply: 3.3V; Operating Temperature: -40℃~+85℃
USB1 = TYPE-C 16PIN 2MD(073): 连接器类型:Type-C;协议标准:-;公母:母;安装方式:卧贴;触点数量:16P;端口数量:1;额定电流 - 电源:3A;工作温度:-25℃~+85℃;; LCSC Part Name: Type-C 母 卧贴; Supplier Part: C2765186; Manufacturer: SHOU HAN(首韩); Supplier Footprint: SMD; JLCPCB Part Class: 扩展库; Datasheet: https://item.szlcsc.com/datasheet/TYPE-C%252016PIN%25202MD(073)/2901843.html; Supplier: LCSC; Connector Type: Type-C; Gender: 母; Mounting Type: 卧贴; Number of Contacts: 16P; Number of Ports: 1; Current Rating-Power: 3A; Voltage Rating: 5V; Connect-Disconnect Life: 5千次; Detection color: 黑色; Operating Temperature: -25℃~+85℃
X2 = X322512MSB4SI: 晶振类型:贴片晶振;频率:12MHz;常温频差:±10ppm;负载电容:20pF;频率稳定度:±20ppm;; LCSC Part Name: YSX321SL 12MHZ 4P 3225 20PF ±10PPM -40~85℃ (±20PPM); Supplier Part: C9002; Manufacturer: YXC(扬兴晶振); Supplier Footprint: SMD3225-4P; JLCPCB Part Class: 基础库; Datasheet: https://item.szlcsc.com/datasheet/X322512MSB4SI/9522.html; Supplier: LCSC; Type: 贴片晶振; Normal temperature Frequency Tolerance: ±10ppm; Load Capacitance: 20pF; Frequency Stability: ±20ppm; Operating Temperature: -40℃~+85℃
C88-C93 C96 C97 = GRM1555C1H180JA01D: 容值:18pF;精度:±5%;额定电压:50V;材质(温度系数):C0G;; LCSC Part Name: 18pF ±5% 50V; Supplier Part: C33149; Manufacturer: muRata(村田); Supplier Footprint: 0402; JLCPCB Part Class: 扩展库; Datasheet: https://atta.szlcsc.com/upload/public/pdf/source/20161108/1478586362936.pdf; Supplier: LCSC; Tolerance: ±5%; Voltage Rated: 50V; Temperature Coefficient: C0G
C95 C99-C101 = GRM1555C1H102JA01D: 容值:1nF;精度:±5%;额定电压:50V;温度系数:C0G;; LCSC Part Name: 1nF ±5% 50V; Supplier Part: C76947; Manufacturer: muRata(村田); Supplier Footprint: 0402; JLCPCB Part Class: 扩展库; Datasheet: https://item.szlcsc.com/datasheet/GRM1555C1H102JA01D/78074.html; Supplier: LCSC; Tolerance: ±5%; Voltage Rating: 50V; Temperature Coefficient: C0G
L11-L13 L16 = TCM1-63AX+: 频率范围:10MHz~6GHz;阻抗比-不平衡/平衡:50Ω:50Ω;插入损耗(最大值):-;相位差:8°;回波损耗(最小值):9.42dB;; Supplier Part: C494678; Manufacturer: Mini-Circuits; Supplier Footprint: SMD-6P; JLCPCB Part Class: 扩展库; Datasheet: https://item.szlcsc.com/datasheet/TCM1-63AX%252B/505421.html; Supplier: LCSC; Frequency Range: 10MHz~6GHz; Impedance - Unbalanced/Balanced: 50Ω:50Ω; Phase Difference: 8°; Amplitude Balance (Max): 0.5dB; Return Loss(Min): 9.42dB; Operating Temperature: -40℃~+85℃
L14 L15 L17 L18 = LQW15CNR33J10D: 电感值:330nH;精度:±5%;额定电流:390mA;饱和电流(Isat):-;; LCSC Part Name: 330nH ±5%; Supplier Part: C703730; Manufacturer: muRata(村田); Supplier Footprint: 0402; JLCPCB Part Class: 扩展库; Datasheet: https://atta.szlcsc.com/upload/public/pdf/source/20191022/C440248_094C93E028FCF0FA66FA57BC1ADCD3EF.pdf; Supplier: LCSC; Tolerance: ±5%; Rated Current: 390mA; DC Resistance (DCR): 560mΩ
R26 R28 = 0402WGF499JTCE: 电阻类型:厚膜电阻;阻值:49.9Ω;精度:±1%;功率:62.5mW;工作电压:50V;温度系数:±100ppm/℃;; LCSC Part Name: 49.9Ω ±1% 62.5mW 厚膜电阻; Supplier Part: C25120; Manufacturer: UNI-ROYAL(厚声); Supplier Footprint: 0402; JLCPCB Part Class: 基础库; Datasheet: https://item.szlcsc.com/datasheet/0402WGF499JTCE/25863.html; Supplier: LCSC; Type: 厚膜电阻; Tolerance: ±1%; Power(Watts): 62.5mW; Voltage-Supply(Max): 50V; Temperature Coefficient: ±100ppm/℃; Operating Temperature: -55℃~+155℃
R27 R29 = 0402WGF100JTCE: 电阻类型:厚膜电阻;阻值:10Ω;精度:±1%;功率:62.5mW;最大工作电压:50V;温度系数:±200ppm/℃;; LCSC Part Name: 10Ω ±1% 62.5mW 厚膜电阻; Supplier Part: C25077; Manufacturer: UNI-ROYAL(厚声); Supplier Footprint: 0402; JLCPCB Part Class: 基础库; Datasheet: https://atta.szlcsc.com/upload/public/pdf/source/20200306/C422600_1E6D84923E4A46A82E41ADD87F860B5C.pdf; Supplier: LCSC; Type: 厚膜电阻; Tolerance: ±1%; Power(Watts): 62.5mW; Overload Voltage (Max): 50V; Temperature Coefficient: ±200ppm/℃; Operating Temperature Range: -55℃~+155℃
RF2-RF7 = BWSMA-KE-P001: 连接器类型:板端;接口类型:内孔;端口数量:1;接口直径:5.2mm;接口长度/高度:-;频率:-;射频系列:SMA;阻抗:50Ω;样式:偏脚;工作温度:-;; LCSC Part Name: 内孔 SMA 偏脚; Supplier Part: C496550; Manufacturer: BAT WIRELESS(蝙蝠无线); Supplier Footprint: SMD; JLCPCB Part Class: 扩展库; Datasheet: https://atta.szlcsc.com/upload/public/pdf/source/20240320/28FD502871C976DFF213ABFCF2A0ED51.pdf; Supplier: LCSC; Connector Type: 板端; Interface: 内孔; Number of Ports: 1; Interface Diameter: 5.2mm; RF Series: SMA; Impedance: 50Ω; Style: 偏脚
C130 = CL05A225KO5NQNC: 容值:2.2uF;精度:±10%;额定电压:16V;温度系数:X5R;; LCSC Part Name: 2.2uF ±10% 16V; Supplier Part: C170151; Manufacturer: SAMSUNG(三星); Supplier Footprint: 0402; JLCPCB Part Class: 扩展库; Datasheet: https://item.szlcsc.com/datasheet/CL05A225KO5NQNC/181536.html; Supplier: LCSC; Tolerance: ±10%; Voltage Rating: 16V; Temperature Coefficient: X5R
R77 = 0402WGF330JTCE: 电阻类型:厚膜电阻;阻值:33Ω;精度:±1%;功率:62.5mW;工作电压:50V;温度系数:±100ppm/℃;; LCSC Part Name: 33Ω ±1% 62.5mW 厚膜电阻; Supplier Part: C25105; Manufacturer: UNI-ROYAL(厚声); Supplier Footprint: 0402; JLCPCB Part Class: 基础库; Datasheet: https://item.szlcsc.com/datasheet/0402WGF330JTCE/25848.html; Supplier: LCSC; Type: 厚膜电阻; Tolerance: ±1%; Power(Watts): 62.5mW; Voltage-Supply(Max): 50V; Temperature Coefficient: ±100ppm/℃; Operating Temperature: -55℃~+155℃
R78 = 0402WGF1001TCE: 电阻类型:厚膜电阻;阻值:1kΩ;精度:±1%;功率:62.5mW;工作电压:50V;温度系数:±100ppm/℃;; LCSC Part Name: 1kΩ ±1% 62.5mW 厚膜电阻; Supplier Part: C11702; Manufacturer: UNI-ROYAL(厚声); Supplier Footprint: 0402; JLCPCB Part Class: Basic Part; Datasheet: https://item.szlcsc.com/datasheet/0402WGF1001TCE/12256.html; Supplier: LCSC; Type: 厚膜电阻; Tolerance: ±1%; Power(Watts): 62.5mW; Voltage-Supply(Max): 50V; Temperature Coefficient: ±100ppm/℃; Operating Temperature: -55℃~+155℃
R80 = RT0402BRD078K06L: 电阻类型:薄膜电阻;阻值:8.06kΩ;精度:±0.1%;功率:62.5mW;温度系数:±25ppm/℃;; LCSC Part Name: 薄膜电阻 8.06kΩ ±0.1% 62.5mW; Supplier Part: C852941; Manufacturer: YAGEO(国巨); Supplier Footprint: 0402; JLCPCB Part Class: 扩展库; Datasheet: https://item.szlcsc.com/datasheet/RT0402BRD078K06L/913263.html; Supplier: LCSC; Type: 薄膜电阻; Tolerance: ±0.1%; Power(Watts): 62.5mW; Temperature Coefficient: ±25ppm/℃; Operating Temperature: -55℃~+155℃
U15 = USB3320C-EZK: 应用功能:收发器;接口协议:USB 2.0;; LCSC Part Name: USB3320 高度集成全功能高速USB 2.0 ULPI收发器; Supplier Part: C52447; Manufacturer: MICROCHIP(美国微芯); Supplier Footprint: QFN-32-EP(5x5); JLCPCB Part Class: 扩展库; Datasheet: https://atta.szlcsc.com/upload/public/pdf/source/20210326/C52447_82C15BC01EB7B75485FAEA128A6533A1.pdf; Supplier: LCSC; Applications Function: 收发器; Protocol: USB 2.0; Supply Voltage: 1.8V~3.3V; Operating Temperature: -40℃~+85℃
X3 = X322524MOB4SI: 晶振类型:贴片晶振;频率:24MHz;常温频差:±10ppm;负载电容:12pF;频率稳定度:±20ppm;; LCSC Part Name: YSX321SL 24MHZ 4P 3225 12PF ±10PPM -40~85℃ (±20PPM); Supplier Part: C70590; Manufacturer: YXC(扬兴晶振); Supplier Footprint: SMD3225-4P; JLCPCB Part Class: 扩展库; Datasheet: https://item.szlcsc.com/datasheet/X322524MOB4SI/71688.html; Supplier: LCSC; Type: 贴片晶振; Normal temperature Frequency Tolerance: ±10ppm; Load Capacitance: 12pF; Frequency Stability: ±20ppm; Operating Temperature: -40℃~+85℃

## Nets
1V3_B: C94.2 C95.2 C98.2 C99.2 L14.1 L15.1 L17.1 L18.1 ; also on sheet 2 3
3V3: R86.2 R87.2 R88.2 R89.2 R90.2 ; also on sheet 2 3 4
5V: C122.1 C123.2 C124.2 C141.1 C144.1 F1.2 LED4.2(A) LED5.2(A) LED6.2(A) Q7.2(S) R78.2 U10.3(VDD5) U10.9(VBUS) U11.15(V5) U12.1(VIN) U12.3(CE) U13.1(VIN) U13.3(CE) ; also on sheet 1 3 4
GND: C94.1 C95.1 C98.1 C99.1 C106.2 C107.2 C108.2 C109.2 C110.1 C111.1 C112.1 C113.1 C114.1 C115.1 C116.1 C117.1 C119.1 C120.1 C121.2 C122.2 C123.1 C124.1 C125.1 C126.1 C130.2 C131.1 C132.1 C133.2 C134.2 C135.1 C136.1 C137.1 C138.1 C139.2 C140.2 C141.2 C144.2 C145.1 C146.2 C149.1 C150.1 C151.1 CN1.10 D3.2(GND) L11.1(NOT USED) L11.2(PRIMARY) L11.5(NOT USED) L12.1(NOT USED) L12.2(PRIMARY) L12.5(NOT USED) L13.1(NOT USED) L13.2(PRIMARY) L13.5(NOT USED) L16.1(NOT USED) L16.2(PRIMARY) L16.5(NOT USED) NC.2 Q4.2(S) Q5.2(S) Q6.2(S) R26.1 R28.1 R30.2 R31.2 R46.2 R60.1 R61.2 R64.2 R65.2 R67.2 R68.2 R69.2 R75.2 R80.2 RF2.1 RF2.2 RF2.3 RF2.4 RF3.1 RF3.2 RF3.3 RF3.4 RF4.1 RF4.2 RF4.3 RF4.4 RF5.1 RF5.2 RF5.3 RF5.4 RF6.1 RF6.2 RF6.3 RF6.4 RF7.1 RF7.2 RF7.3 RF7.4 U9.41(GND) U10.2(GND) U10.17(EP) U11.17(GND) U12.2(VSS) U13.2(VSS) U15.33(GND) USB1.1(GND) USB1.12(GND) USB1.13(SHELL) USB1.14(SHELL) X2.2(GND) X2.4(GND) X3.2(GND) X3.4(GND) X4.2(GND) X4.4(GND) ; also on sheet 1 2 3 4
GNDS: C127.1 D8.2 R60.2 U14.9(LED+) U14.10(LED-)
VBUS: D3.5(VCC) F1.1 USB1.2(VBUS) USB1.11(VBUS)
ARM_UART_RX: U10.4(TXD) ; also on sheet 4
ARM_UART_TX: U10.5(RXD) ; also on sheet 4
BANK5_H19_IOR41B: U15.31(DIR) ; also on sheet 1
BANK5_H20_IOR43A: U15.2(NXT) ; also on sheet 1
BANK5_H22_IOR45B: R93.2 U15.27(RESETB) ; also on sheet 1
BANK5_J19_IOR41A: R77.1 ; also on sheet 1
BANK5_J22_IOR45A: U15.29(STP) ; also on sheet 1
BANK5_K21_IOR59A: U15.10(DATA6) ; also on sheet 1
BANK5_K22_IOR59B: U15.13(DATA7) ; also on sheet 1
BANK5_L19_IOR61A: U15.3(DATA0) ; also on sheet 1
BANK5_L20_IOR61B: U15.9(DATA5) ; also on sheet 1
BANK5_L21_IOR68B: U15.4(DATA1) ; also on sheet 1
BANK5_M21_IOR68A: U15.5(DATA2) ; also on sheet 1
BANK5_M22_IOR63B: U15.6(DATA3) ; also on sheet 1
BANK5_N22_IOR63A: U15.7(DATA4) ; also on sheet 1
BANK8_AA18_IOB77A: Q6.1(G) ; also on sheet 1
BANK8_AA19_IOB85A: U9.18(TXD0) ; also on sheet 1
BANK8_AB18_IOB77B: C109.1 R92.2 U9.12(PHYRSTB) ; also on sheet 1
BANK8_AB20_IOB85B: U9.17(TXD1) ; also on sheet 1
BANK8_AB21_IOB97A: U9.16(TXD2) ; also on sheet 1
BANK8_AB22_IOB97B: U9.15(TXD3) ; also on sheet 1
BANK8_U17_IOB75A: R69.1 R72.2 U9.25(RXDLY/RXD0) ; also on sheet 1
BANK8_U18_IOB75B: R68.1 R71.2 U9.24(TXDLY/RXD1) ; also on sheet 1
BANK8_V17_IOB79A: R67.1 R70.2 U9.23(PLLOFF/RXD2) ; also on sheet 1
BANK8_W17_IOB79B: R66.2 U9.22(PHYAD0/RXD3) ; also on sheet 1
BANK8_W19_IOB93A: U9.20(TXC) ; also on sheet 1
BANK8_W20_IOB93B: U9.19(TXCTL) ; also on sheet 1
BANK8_Y18_IOB87A: R64.1 U9.26(PHYAD2/RXCTL) ; also on sheet 1
BANK8_Y19_IOB87B: R65.1 U9.27(PHYAD1/RXC) ; also on sheet 1
BANK8_Y21_IOB99A: R48.1 U9.14(MDIO) ; also on sheet 1
BANK8_Y22_IOB99B: R47.1 U9.13(MDC) ; also on sheet 1
BANK12_R13_JTAG_TDI: CN1.9 R87.1 ; also on sheet 1
BANK12_T13_JTAG_TMS: CN1.5 R90.1 ; also on sheet 1
BANK12_U13_JTAG_TDO: CN1.3 R89.1 ; also on sheet 1
BANK12_V12_JTAG_TCK: CN1.1 R88.1 ; also on sheet 1
DN: D3.1(I/O) D3.6(I/O) U11.11(DMU) USB1.5(DN2) USB1.7(DN1)
DP: D3.3(I/O) D3.4(I/O) U11.12(DPU) USB1.6(DP1) USB1.8(DP2)
ETH0_MDI0_N: L23.14(TX+) U14.2
ETH0_MDI0_P: L23.13(TX-) U14.1
ETH0_MDI1_N: L23.18(TX+) U14.6
ETH0_MDI1_P: L23.17(TX-) U14.3
ETH0_MDI2_N: L23.20(TX+) U14.5
ETH0_MDI2_P: L23.19(TX-) U14.4
ETH0_MDI3_N: L23.24(TX+) U14.8
ETH0_MDI3_P: L23.23(TX-) U14.7
JTAG_VREF: CN1.4 R86.1
PHY0_1V8: C125.2 C135.2 C136.2 C137.2 C140.1 L22.1 R93.1 U10.1(VIO) U13.5(VOUT) U15.8(REFSEL0) U15.11(REFSEL1) U15.14(REFSEL2) U15.28(VDD18) U15.30(VDD18) U15.32(VDDIO)
PHY0_3V3: C121.1 C131.2 C132.2 L20.1 L21.1 U12.5(VOUT) U15.21(VBAT)
PHY0_AVDD_1V0: C115.2 C116.2 C117.2 C149.2 C150.2 C151.2 R50.2 U9.3(AVDD10) U9.8(AVDD10) U9.38(AVDD10)
PHY0_AVDD_3V3: C110.2 C111.2 L20.2 U9.11(AVDD33) U9.40(AVDD33)
PHY0_DVDD_1V0: C114.2 R49.2 U9.21(DVDD10)
PHY0_DVDD_3V3: C112.2 C113.2 L21.2 U9.29(DVDD33)
PHY0_LED0/CFG_EXT: Q7.1(G) R73.2 U9.32(CFG_EXT/LED0)
PHY0_LED1/CFG_LDO0: Q4.1(G) R75.1 U9.33(CFG_LDO0/LED1)
PHY0_LED2/CFG_LDO1: Q5.1(G) R74.2 U9.34(CFG_LDO1/LED2)
PHY0_MDI0_N: R57.1 U9.2(MDIN0)
PHY0_MDI0_P: R58.1 U9.1(MDIP0)
PHY0_MDI1_N: R55.1 U9.5(MDIN1)
PHY0_MDI1_P: R56.1 U9.4(MDIP1)
PHY0_MDI2_N: R53.1 U9.7(MDIN2)
PHY0_MDI2_P: R54.1 U9.6(MDIP2)
PHY0_MDI3_N: R51.1 U9.10(MDIN3)
PHY0_MDI3_P: R52.1 U9.9(MDIP3)
PHY0_REG_1V0: C107.1 C108.1 L19.2 R49.1 R50.1
PHY0_VIO: C119.2 C120.2 L22.2 R47.2 R48.2 R66.1 R70.1 R71.1 R72.1 R73.1 R74.1 R92.1 U9.28(DVDD_RG)
PHY0_XTAL_IN: C139.1 R85.1 U9.36(XTAL_IN) X4.1(OSC1)
PHY0_XTAL_OUT: C138.2 R85.2 U9.37(XTAL_OUT/EXT_CLK) X4.3(OSC2)
RX1A_N: C88.2 ; also on sheet 2
RX1A_P: C89.2 ; also on sheet 2
RX2A_N: C90.2 ; also on sheet 2
RX2A_P: C91.2 ; also on sheet 2
TX1A_N: C93.1 L15.2 ; also on sheet 2
TX1A_P: C92.1 L14.2 ; also on sheet 2
TX2A_N: C97.1 L18.2 ; also on sheet 2
TX2A_P: C96.1 L17.2 ; also on sheet 2
TX_MON1: C100.2 ; also on sheet 2
TX_MON2: C101.2 ; also on sheet 2
USART_DN: U10.8(UD-) U11.9(DM1)
USART_DP: U10.7(UD+) U11.10(DP1)
USB_DN: U11.7(DM2) U15.19(DM)
USB_DP: U11.8(DP2) U15.18(DP)
$5N375: R31.1 USB1.4(CC1)
$5N379: R30.1 USB1.10(CC2)
$5N1334: C145.2 U10.6(V3)
$5N1646: U11.2(XI) X2.1(OSC1)
$5N1650: U11.1(XO) X2.3(OSC2)
$5N1903: C106.1 C146.1 U11.16(VDD33)
$6N381: L11.3(PRIMARY DOT) RF2.5
$6N492: C88.1 L11.6(SECONDARY-DOT)
$6N497: C89.1 L11.4(SECONDARY)
$6N753: L12.3(PRIMARY DOT) RF3.5
$6N755: C90.1 L12.6(SECONDARY-DOT)
$6N758: C91.1 L12.4(SECONDARY)
$6N915: L13.3(PRIMARY DOT) RF4.5
$6N1077: C92.2 L13.4(SECONDARY)
$6N1083: C93.2 L13.6(SECONDARY-DOT)
$6N1770: C97.2 L16.6(SECONDARY-DOT)
$6N1788: C96.2 L16.4(SECONDARY)
$6N1797: L16.3(PRIMARY DOT) RF5.5
$6N2135: R26.2 R27.1 RF6.5
$6N2141: C100.1 R27.2
$6N2367: C101.1 R29.2
$6N2369: R28.2 R29.1 RF7.5
$7N989: L19.1 U9.30(REG_OUT/LDO_OUT)
$7N1109: NC.1 U9.31(INTB/PMEB)
$7N1265: R46.1 U9.39(RSET)
$7N3719: D4.1 L23.1(TD+) R51.2
$7N3729: D4.2 L23.2(TD-) R52.2
$7N3751: D5.1 L23.5(TD+) R53.2
$7N3757: D5.2 L23.6(TD-) R54.2
$7N3761: D6.1 L23.7(TD+) R55.2
$7N3767: D6.2 L23.8(TD-) R56.2
$7N3774: D7.1 L23.11(TD+) R57.2
$7N3784: D7.2 L23.12(TD-) R58.2
$7N4429: C126.2 L23.3(TDCT) L23.4(TDCT) L23.9(TDCT) L23.10(TDCT)
$7N4503: D8.1 L23.15(TXCT) L23.16(TXCT) L23.21(TXCT) L23.22(TXCT) R59.2
$7N4793: C127.2 R59.1
$7N51860: Q4.3(D) R62.2
$7N51864: Q5.3(D) R63.2
$7N51869: Q6.3(D) R76.2
$8N749: R77.2 U15.1(CLKOUT)
$8N854: C130.1 U15.20(VDD33) U15.23(ID)
$8N1159: R78.1 U15.22(VBUS)
$8N1371: R80.1 U15.24(RBIAS)
$8N1466: C134.1 R81.1 U15.26(REFCLK) X3.1(OSC1)
$8N1479: C133.1 R81.2 U15.25(XO) X3.3(OSC2)
Net-(LED3-1): LED3.1(K) R61.1
Net-(LED3-2): LED3.2(A) Q7.3(D)
Net-(LED4-1): LED4.1(K) R62.1
Net-(LED5-1): LED5.1(K) R63.1
Net-(LED6-1): LED6.1(K) R76.1

Not connected (* = marked no-connect by the designer): CN1 2* 6* 7* 8*; SCREW1 1*; SCREW2 1*; SCREW3 1*; SCREW4 1*; U9 35(CLKOUT)*; U10 10(ACT#)* 11(DCD)* 12(DTRTNOW)* 13(RTS)* 14(DSR)* 15(CTS)* 16(RI)*; U11 3(DM4)* 4(DP4)* 5(DM3)* 6(DP3)* 13(RESET#/CDP)* 14(PGANG)*; U12 4(NC)*; U13 4(NC)*; U15 12(N/C)* 15(SPK_L)* 16(SPK_R)* 17(CPEN)*; USB1 3(SBU2)* 9(SBU1)*

## Notes on the sheets
sheet 5
- TYPEC
- UART
- USB HUB
- 1.5A 保险丝
- TVS
- JTAG
sheet 6
- RX1 INPUT
- TX1 OUTPUT
- RX2 INPUT
- TX2 OUTPUT
- TX MONITOR 1 INPUT
- TX MONITOR 2 INPUT
sheet 7
- RTL8211
- POWER
- MAGNETICS
- 1V8 500mA
- 3V3 800mA
- CONFIG
- INTERFACE
- NC
- NC
- NC
- NC
sheet 8
- NC
